# EasyEDA Pro project ProPrj_承载我所有幻想的键盘_2025-02-09.epro, schematic 07-Schematic
Create Date: 2024-07-30; Page Name: P1; Project Name: 承载我所有幻想的键盘; Schematic Name: Schematic6; Update Date: 2024-07-30
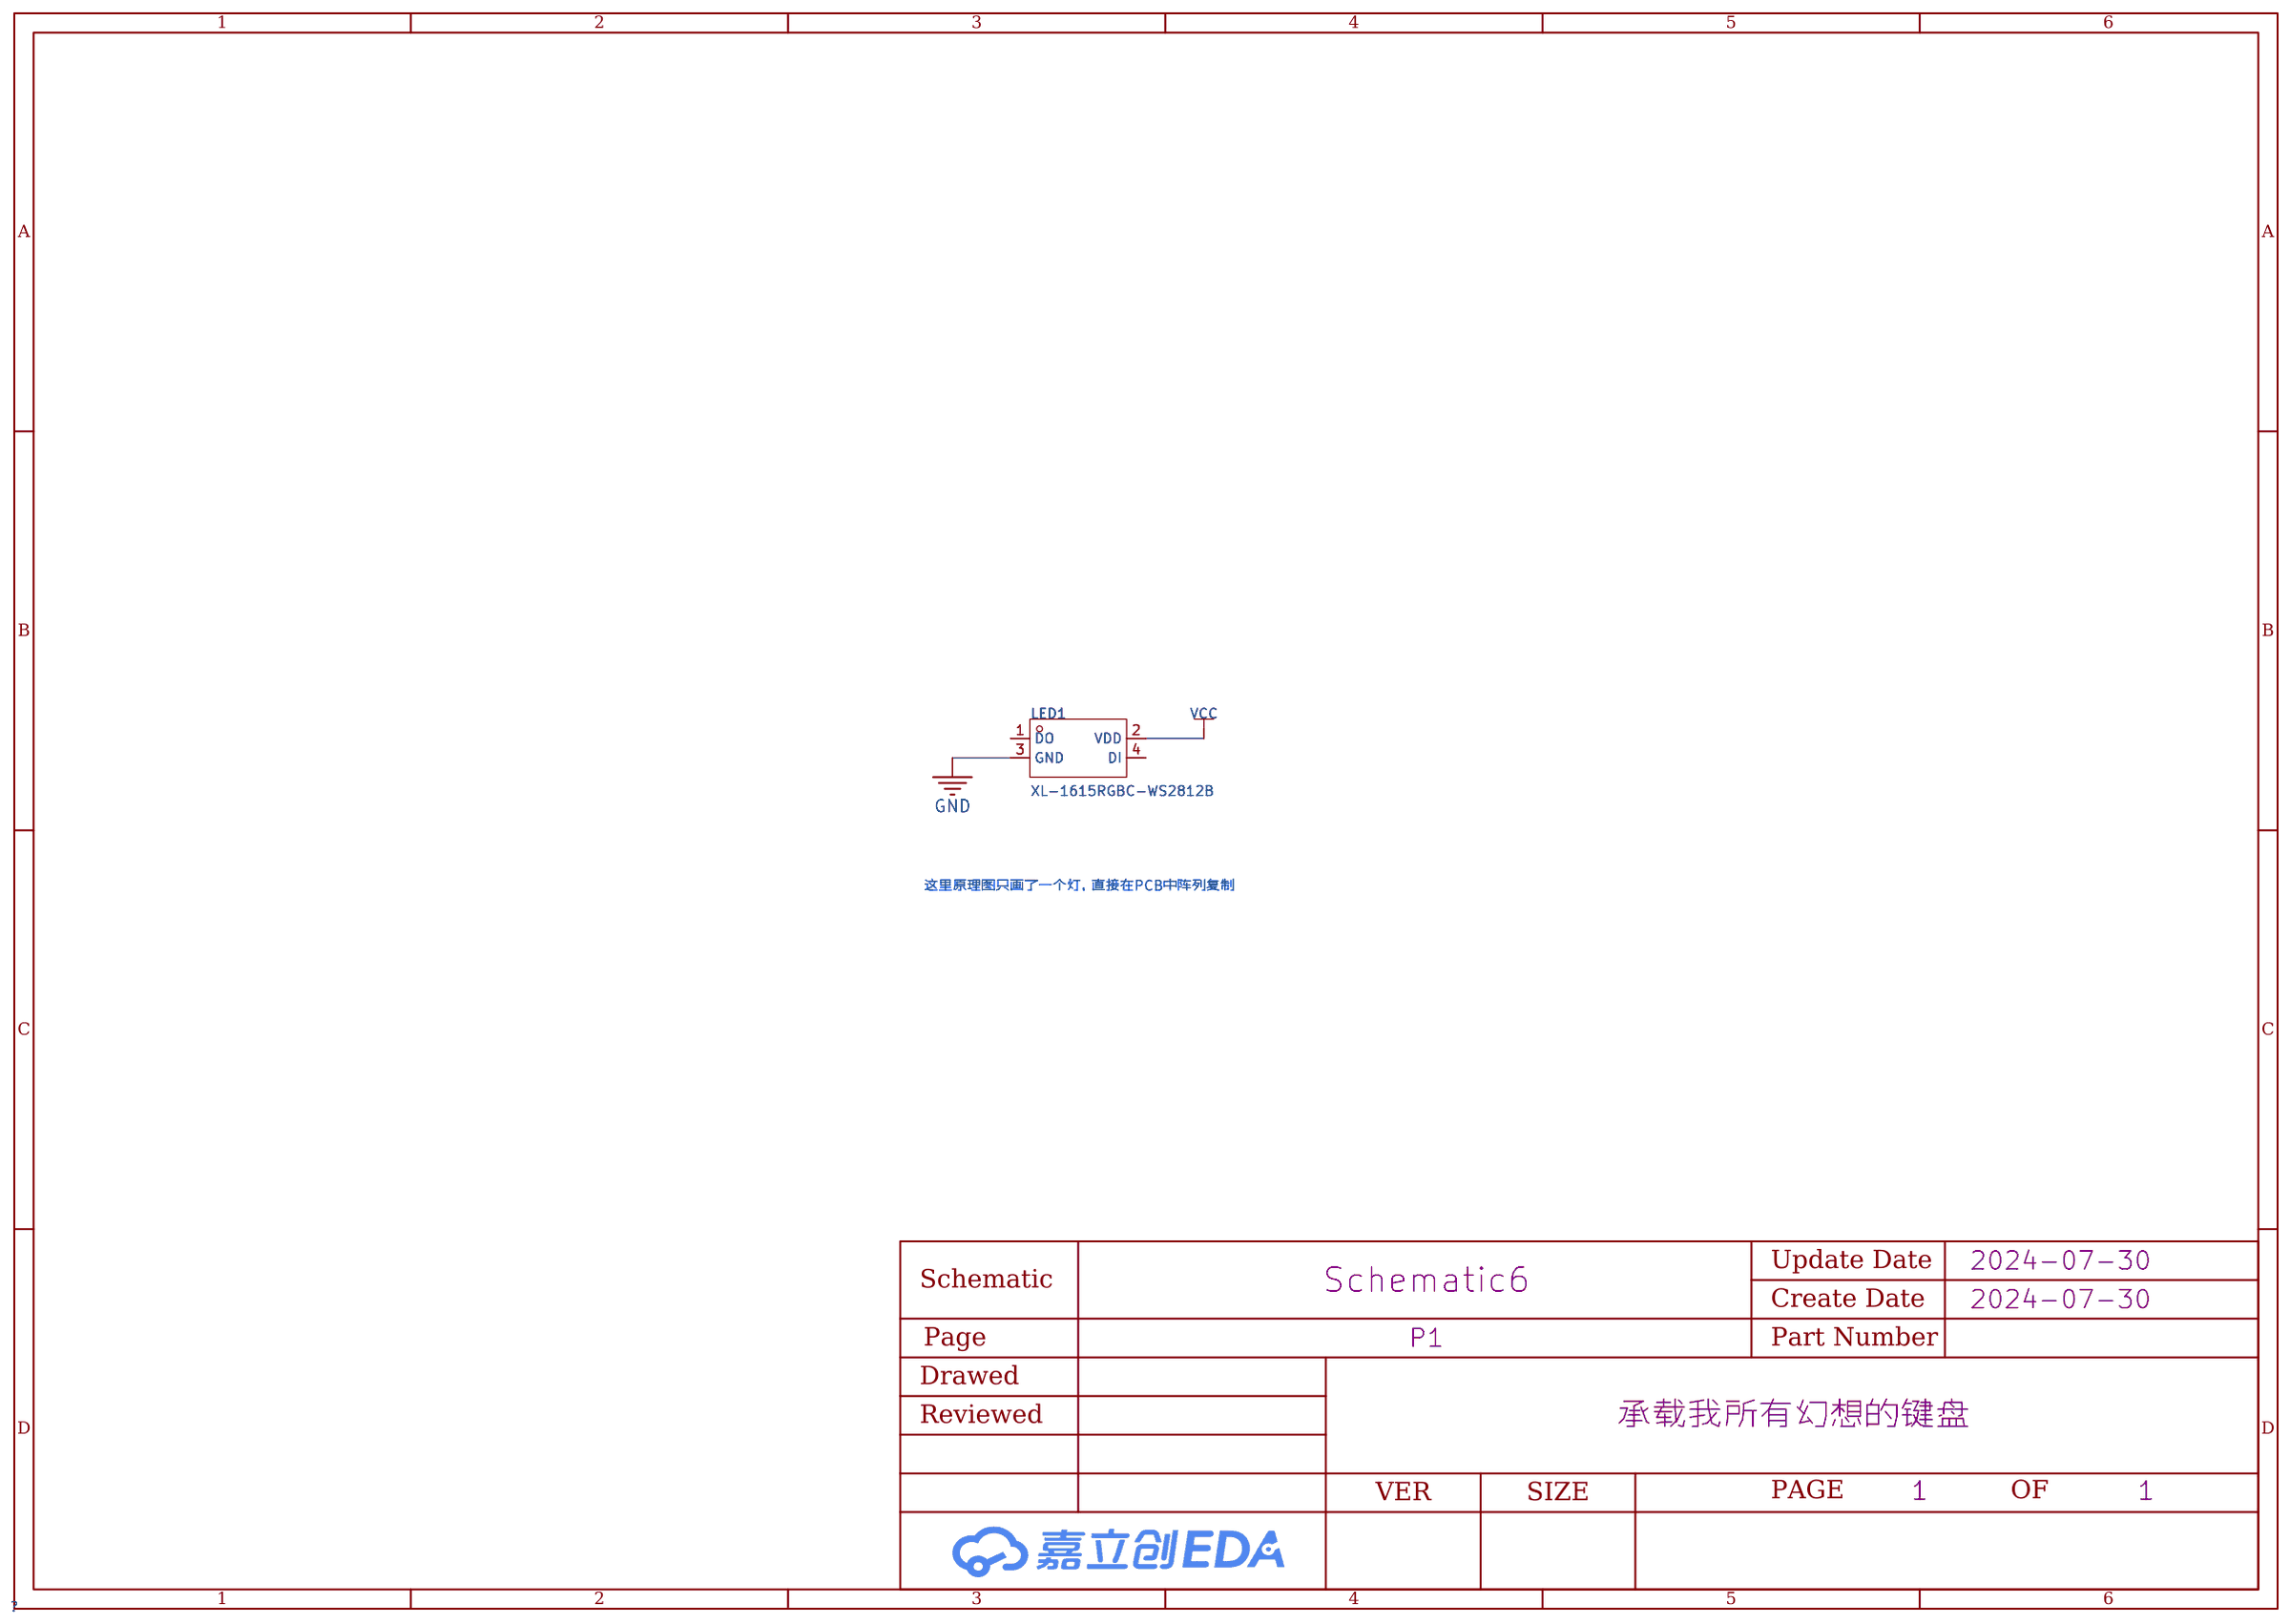
[diagram p14: schematic sheet]

## Parts
LED1  XL-1615RGBC-WS2812B  [LED-SMD_4P-L1.6-W1.5_XL-1615RGBC-WS2812B]

## Library data of the parts
LED1 = XL-1615RGBC-WS2812B: 发光颜色:RGB三色;正向电压(VF):3.5V~5.5V;功率:-;正向电流:5mA;主波长:465nm~470nm；620nm~625nm；525nm~530nm;透镜颜色:无色透明透镜;发光强度:110mcd；130mcd；360mcd;发光角度:120°;载带方式:正贴;工作温度:-20℃~+85℃;; LCSC Part Name: 幻彩透明; Supplier Part: C5349954; Manufacturer: XINGLIGHT(成兴光); Supplier Footprint: 1615; JLCPCB Part Class: 扩展库; Datasheet: https://atta.szlcsc.com/upload/public/pdf/source/20231130/04B49B18F8461F82D29B9C7D48853943.pdf; Supplier: LCSC; Emitted Color: RGB三色; Forward Voltage (VF): 3.5V~5.5V; Forward Current: 5mA; Dominant Wavelength: 465nm~470nm；620nm~625nm；525nm~530nm; Lens Color: 无色透明透镜; Luminous Intensity: 110mcd；130mcd；360mcd; Viewing Angle: 120°; Mounting Sytle: 正贴; Operating Temperature: -20℃~+85℃

## Nets
GND: LED1.3(GND)
VCC: LED1.2(VDD)

Not connected (* = marked no-connect by the designer): LED1 1(DO) 4(DI)

## Notes on the sheet
- 这里原理图只画了一个灯，直接在PCB中阵列复制
